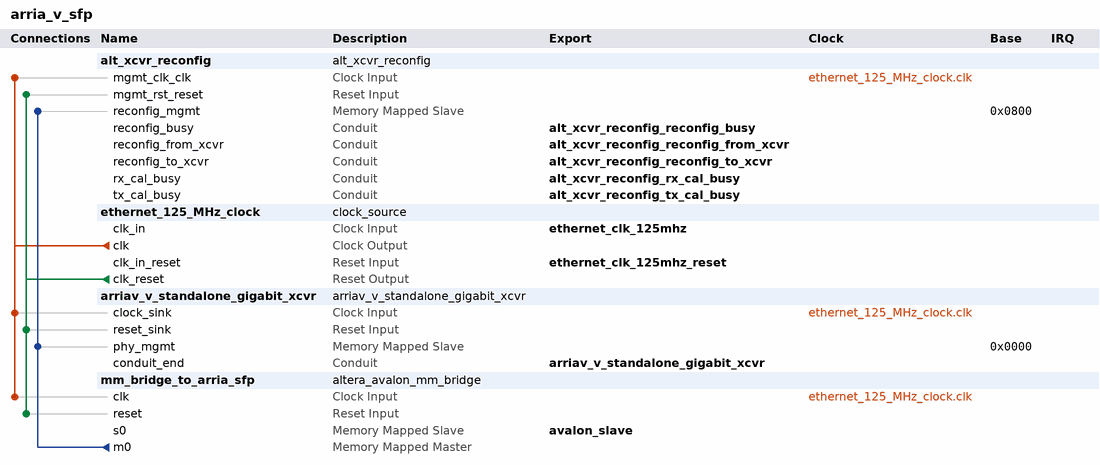
[diagram p0: system contents]
# Platform Designer (Qsys) system arria_v_sfp, Arria V 5ASTFD5K3F40I3ES
# Parameters at their usual value, and those the tool derives, are not listed.
package require -exact qsys 14.1
create_system arria_v_sfp
set_project_property DEVICE_FAMILY {Arria V}
set_project_property DEVICE 5ASTFD5K3F40I3ES

add_instance alt_xcvr_reconfig alt_xcvr_reconfig 14.1
set_instance_parameter_value alt_xcvr_reconfig device_family {Arria V}
set_instance_parameter_value alt_xcvr_reconfig enable_adce 0
set_instance_parameter_value alt_xcvr_reconfig enable_analog 1
set_instance_parameter_value alt_xcvr_reconfig gui_cal_status_port true
set_instance_parameter_value alt_xcvr_reconfig number_of_reconfig_interfaces 2

add_instance ethernet_125_MHz_clock clock_source 14.1
set_instance_parameter_value ethernet_125_MHz_clock clockFrequency 125000000

add_instance arriav_v_standalone_gigabit_xcvr arriav_v_standalone_gigabit_xcvr 1.0

add_instance mm_bridge_to_arria_sfp altera_avalon_mm_bridge 14.1
set_instance_parameter_value mm_bridge_to_arria_sfp ADDRESS_UNITS SYMBOLS
set_instance_parameter_value mm_bridge_to_arria_sfp ADDRESS_WIDTH 16
set_instance_parameter_value mm_bridge_to_arria_sfp DATA_WIDTH 32
set_instance_parameter_value mm_bridge_to_arria_sfp MAX_PENDING_RESPONSES 4
set_instance_parameter_value mm_bridge_to_arria_sfp USE_AUTO_ADDRESS_WIDTH 0

# connections
add_connection ethernet_125_MHz_clock.clk alt_xcvr_reconfig.mgmt_clk_clk clock
add_connection ethernet_125_MHz_clock.clk arriav_v_standalone_gigabit_xcvr.clock_sink clock
add_connection ethernet_125_MHz_clock.clk mm_bridge_to_arria_sfp.clk clock
add_connection ethernet_125_MHz_clock.clk_reset alt_xcvr_reconfig.mgmt_rst_reset reset
add_connection ethernet_125_MHz_clock.clk_reset arriav_v_standalone_gigabit_xcvr.reset_sink reset
add_connection ethernet_125_MHz_clock.clk_reset mm_bridge_to_arria_sfp.reset reset
add_connection mm_bridge_to_arria_sfp.m0 alt_xcvr_reconfig.reconfig_mgmt avalon
set_connection_parameter_value mm_bridge_to_arria_sfp.m0/alt_xcvr_reconfig.reconfig_mgmt baseAddress 0x0800
add_connection mm_bridge_to_arria_sfp.m0 arriav_v_standalone_gigabit_xcvr.phy_mgmt avalon
set_connection_parameter_value mm_bridge_to_arria_sfp.m0/arriav_v_standalone_gigabit_xcvr.phy_mgmt baseAddress 0x0000

# exported interfaces
add_interface alt_xcvr_reconfig_reconfig_busy conduit end
set_interface_property alt_xcvr_reconfig_reconfig_busy EXPORT_OF alt_xcvr_reconfig.reconfig_busy
add_interface alt_xcvr_reconfig_reconfig_from_xcvr conduit end
set_interface_property alt_xcvr_reconfig_reconfig_from_xcvr EXPORT_OF alt_xcvr_reconfig.reconfig_from_xcvr
add_interface alt_xcvr_reconfig_reconfig_to_xcvr conduit end
set_interface_property alt_xcvr_reconfig_reconfig_to_xcvr EXPORT_OF alt_xcvr_reconfig.reconfig_to_xcvr
add_interface alt_xcvr_reconfig_rx_cal_busy conduit end
set_interface_property alt_xcvr_reconfig_rx_cal_busy EXPORT_OF alt_xcvr_reconfig.rx_cal_busy
add_interface alt_xcvr_reconfig_tx_cal_busy conduit end
set_interface_property alt_xcvr_reconfig_tx_cal_busy EXPORT_OF alt_xcvr_reconfig.tx_cal_busy
add_interface arriav_v_standalone_gigabit_xcvr conduit end
set_interface_property arriav_v_standalone_gigabit_xcvr EXPORT_OF arriav_v_standalone_gigabit_xcvr.conduit_end
add_interface avalon_slave avalon slave
set_interface_property avalon_slave EXPORT_OF mm_bridge_to_arria_sfp.s0
add_interface ethernet_clk_125mhz clock sink
set_interface_property ethernet_clk_125mhz EXPORT_OF ethernet_125_MHz_clock.clk_in
add_interface ethernet_clk_125mhz_reset reset sink
set_interface_property ethernet_clk_125mhz_reset EXPORT_OF ethernet_125_MHz_clock.clk_in_reset

set_interconnect_requirement {$system} qsys_mm.clockCrossingAdapter HANDSHAKE
set_interconnect_requirement {$system} qsys_mm.maxAdditionalLatency 2

save_system arria_v_sfp.qsys
